# EAGLE design RelayWing (EAGLE 9.1.3)
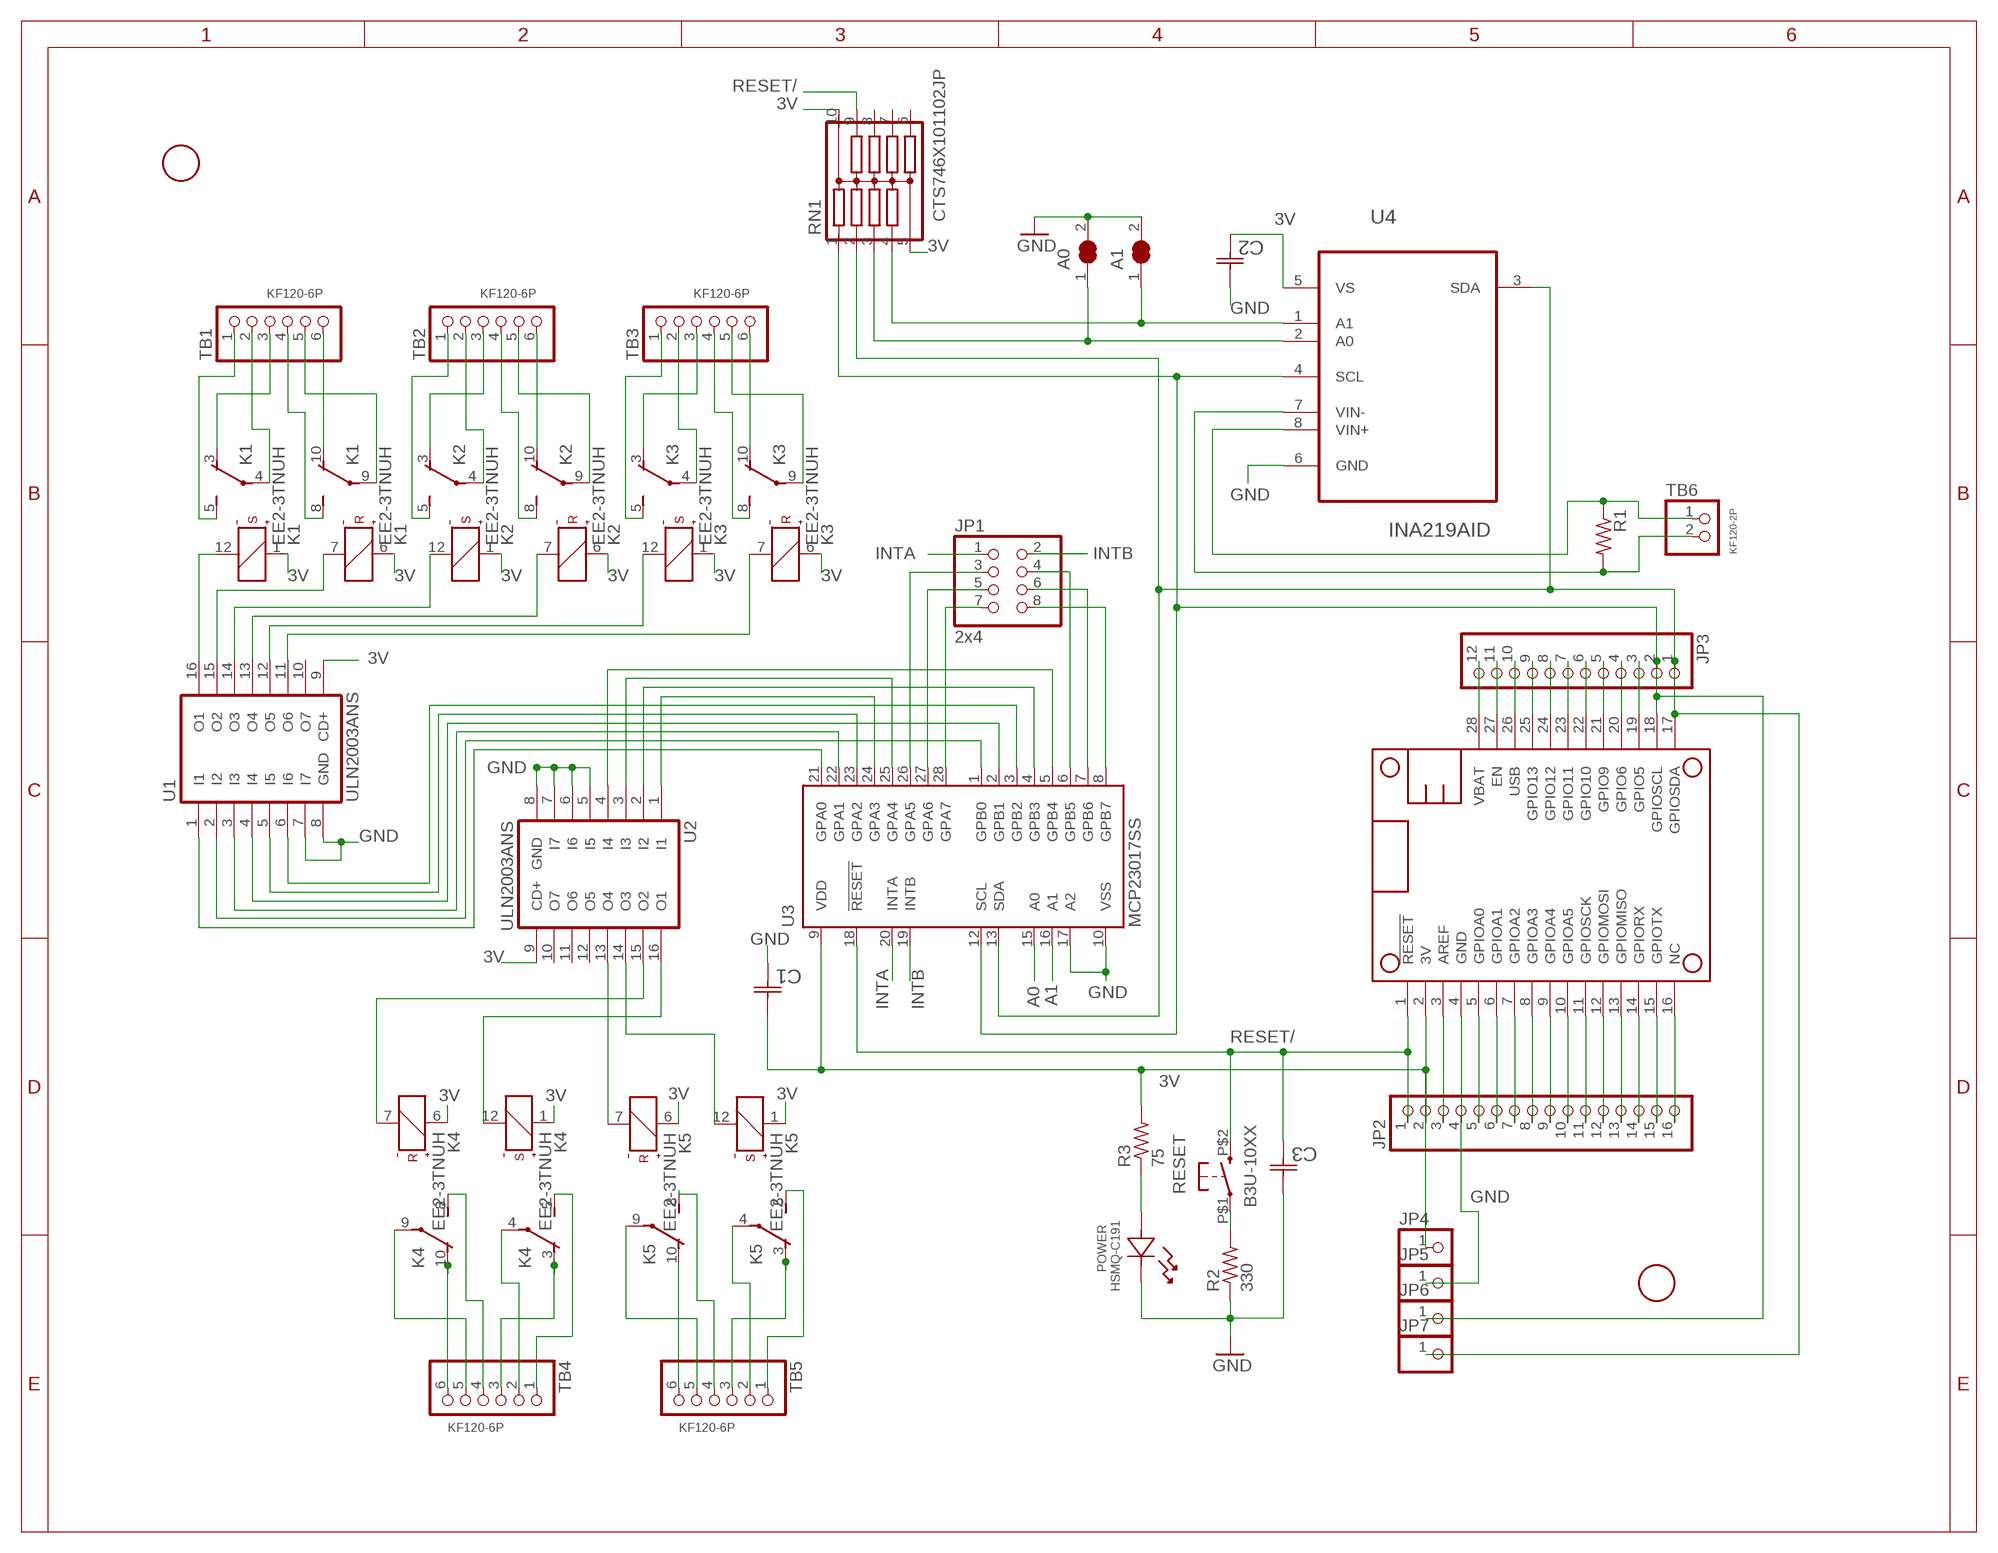
[diagram p0: schematic, sheet 1]

## Parts
A0  SJW-SHORTED  [SJW-SHORTED]
A1  SJW-SHORTED  [SJW-SHORTED]
C1  MUR-1220-CAP  [CAPC2012]
C2  MUR-1220-CAP  [CAPC2012]
C3  MUR-1220-CAP  [CAPC2012]
JP1  2x4  PINHD-2X4  [2X04]
JP2  PINHD-1X16  [1X16]
JP3  PINHD-1X12  [1X12]
JP4  PINHD-1X1CB  [1X01-CLEANBIG]
JP5  PINHD-1X1CB  [1X01-CLEANBIG]
JP6  PINHD-1X1CB  [1X01-CLEANBIG]
JP7  PINHD-1X1CB  [1X01-CLEANBIG]
K1  EE2-3TNUH  [NUH]
K2  EE2-3TNUH  [NUH]
K3  EE2-3TNUH  [NUH]
K4  EE2-3TNUH  [NUH]
K5  EE2-3TNUH  [NUH]
MS1  FEATHERWING_NODIM  [FEATHERWING_DIM]
POWER  HSMQ-C191  [LED3_HSMX-C120]
R1  0.1  R-US_M3216  [M3216]
R2  330  R-US_R0603  [R0603]
R3  75  R-US_R0603  [R0603]
RESET  B3U-10XX  [B3U-10XX]
RN1  CTS746X101102JP  CTS746X  [CTS746X101]
TB1  KF120-6P  [KF120-6P_ROUND]
TB2  KF120-6P  [KF120-6P_ROUND]
TB3  KF120-6P  [KF120-6P_ROUND]
TB4  KF120-6P  [KF120-6P_ROUND]
TB5  KF120-6P  [KF120-6P_ROUND]
TB6  KF120-2P  [KF120-2P_ROUND]
U1  ULN2003ANS  [SO16-NS]
U2  ULN2003ANS  [SO16-NS]
U3  MCP23017SS  [SSOP28]
U4  INA219AID  [SOIC127P600X175-8N]
U$2  FIDUCIAL  [FIDUCIAL_1MM]
U$3  FIDUCIAL  [FIDUCIAL_1MM]

## Nets
3V: C1.1(C1) C2.2(C2) JP2.2 JP4.1 K1.1(S:+) K1.6(R:+) K2.1(S:+) K2.6(R:+) K3.1(S:+) K3.6(R:+) K4.1(S:+) K4.6(R:+) K5.1(S:+) K5.6(R:+) MS1.2(3V) R3.2 RN1.5(5C) RN1.10(10C) U1.9(CD+) U2.9(CD+) U3.9(VDD) U4.5(VS)
A0: A0.1 RN1.3 U3.15(A0) U4.2(A0)
A1: A1.1 RN1.4 U3.16(A1) U4.1(A1)
GND: A0.2 A1.2 C1.2(C2) C2.1(C1) C3.1(C1) JP2.4 JP5.1 MS1.4(GND) POWER.1 R2.1 U1.7(I7) U1.8(GND) U2.5(I5) U2.6(I6) U2.7(I7) U2.8(GND) U3.10(VSS) U3.17(A2) U4.6(GND)
GPA0: U1.1(I1) U3.21(GPA0)
GPA1: U1.3(I3) U3.22(GPA1)
GPA2: U1.5(I5) U3.23(GPA2)
GPA3: U2.1(I1) U3.24(GPA3)
GPA4: U2.3(I3) U3.25(GPA4)
GPA5: JP1.3 U3.26(GPA5)
GPA6: JP1.5 U3.27(GPA6)
GPA7: JP1.7 U3.28(GPA7)
GPB0: U1.2(I2) U3.1(GPB0)
GPB1: U1.4(I4) U3.2(GPB1)
GPB2: U1.6(I6) U3.3(GPB2)
GPB3: U2.2(I2) U3.4(GPB3)
GPB4: U2.4(I4) U3.5(GPB4)
GPB5: JP1.4 U3.6(GPB5)
GPB6: JP1.6 U3.7(GPB6)
GPB7: JP1.8 U3.8(GPB7)
INTA: JP1.1 U3.20(INTA)
INTB: JP1.2 U3.19(INTB)
K1-RESET: K1.7(R:-) U1.15(O2)
K1-SET: K1.12(S:-) U1.16(O1)
K1A-CO [Two Amp]: K1.4(1:P) TB1.2
K1A-NC [Two Amp]: K1.3(1:O) TB1.3
K1A-NO [Two Amp]: K1.5(1:S) TB1.1
K1B-CO [Two Amp]: K1.9(2:P) TB1.5
K1B-NC [Two Amp]: K1.10(2:O) TB1.6
K1B-NO [Two Amp]: K1.8(2:S) TB1.4
K2-RESET: K2.7(R:-) U1.13(O4)
K2-SET: K2.12(S:-) U1.14(O3)
K2A-CO [Two Amp]: K2.4(1:P) TB2.2
K2A-NC [Two Amp]: K2.3(1:O) TB2.3
K2A-NO [Two Amp]: K2.5(1:S) TB2.1
K2B-CO [Two Amp]: K2.9(2:P) TB2.5
K2B-NC [Two Amp]: K2.10(2:O) TB2.6
K2B-NO [Two Amp]: K2.8(2:S) TB2.4
K3-RESET: K3.7(R:-) U1.11(O6)
K3-SET: K3.12(S:-) U1.12(O5)
K3A-CO [Two Amp]: K3.4(1:P) TB3.2
K3A-NC [Two Amp]: K3.3(1:O) TB3.3
K3A-NO [Two Amp]: K3.5(1:S) TB3.1
K3B-CO [Two Amp]: K3.9(2:P) TB3.5
K3B-NC [Two Amp]: K3.10(2:O) TB3.6
K3B-NO [Two Amp]: K3.8(2:S) TB3.4
K4-RESET: K4.7(R:-) U2.15(O2)
K4-SET: K4.12(S:-) U2.16(O1)
K4A-CO [Two Amp]: K4.4(1:P) TB4.2
K4A-N0 [Two Amp]: K4.5(1:S) TB4.1
K4A-NC [Two Amp]: K4.3(1:O) TB4.3
K4B-CO [Two Amp]: K4.9(2:P) TB4.5
K4B-NC [Two Amp]: K4.10(2:O) TB4.6
K4B-NO [Two Amp]: K4.8(2:S) TB4.4
K5-RESET: K5.7(R:-) U2.13(O4)
K5-SET: K5.12(S:-) U2.14(O3)
K5A-CO [Two Amp]: K5.4(1:P) TB5.2
K5A-NC [Two Amp]: K5.3(1:O) TB5.3
K5A-NO [Two Amp]: K5.5(1:S) TB5.1
K5B-CO [Two Amp]: K5.9(2:P) TB5.5
K5B-NC [Two Amp]: K5.10(2:O) TB5.6
K5B-NO [Two Amp]: K5.8(2:S) TB5.4
N$1: JP2.3 MS1.3(AREF)
N$2: POWER.2 R3.1
N$3: JP2.5 MS1.5(GPIOA0)
N$4: JP2.6 MS1.6(GPIOA1)
N$5: JP2.7 MS1.7(GPIOA2)
N$6: JP2.8 MS1.8(GPIOA3)
N$7: JP2.9 MS1.9(GPIOA4)
N$8: JP2.10 MS1.10(GPIOA5)
N$9: JP2.11 MS1.11(GPIOSCK)
N$10: JP2.12 MS1.12(GPIOMOSI)
N$11: JP2.13 MS1.13(GPIOMISO)
N$12: JP2.14 MS1.14(GPIORX)
N$13: JP2.15 MS1.15(GPIOTX)
N$14: JP2.16 MS1.16(NC)
N$15: JP3.3 MS1.19(GPIO5)
N$19: JP3.4 MS1.20(GPIO6)
N$20: JP3.5 MS1.21(GPIO9)
N$21: JP3.6 MS1.22(GPIO10)
N$22: JP3.7 MS1.23(GPIO11)
N$23: JP3.8 MS1.24(GPIO12)
N$31: R2.2 RESET.P$1(P)
N$51: JP3.9 MS1.25(GPIO13)
N$61: JP3.11 MS1.27(EN)
RESET/: C3.2(C2) JP2.1 MS1.1(!RESET) RESET.P$2(S) RN1.9 U3.18(!RESET)
SCL: JP3.2 JP6.1 MS1.18(GPIOSCL) RN1.1 U3.12(SCL) U4.4(SCL)
SDA: JP3.1 JP7.1 MS1.17(GPIOSDA) RN1.2 U3.13(SDA) U4.3(SDA)
USB: JP3.10 MS1.26(USB)
VBAT: JP3.12 MS1.28(VBAT)
VIN+: R1.1 TB6.1 U4.8(VIN+)
VIN-: R1.2 TB6.2 U4.7(VIN-)
Unconnected: RN1.6 RN1.7 RN1.8 U1.10(O7) U2.10(O7) U2.11(O6) U2.12(O5)

## Library data of the parts
A0 A1 = home:SJW-SHORTED: SMD solder JUMPER
C1-C3 = home:MUR-1220-CAP: CAPACITOR, 0805
JP1 = pinhead:PINHD-2X4: PIN HEADER
JP2 = pinhead:PINHD-1X16: PIN HEADER
JP3 = pinhead:PINHD-1X12: PIN HEADER
JP4-JP7 = adafruit:PINHD-1X1: Pin header 1x1 for 0.1" spacing With round pins
K1-K5 = home:EE2-*T?: TX Relay 2 coil latching 2 AMP. HIGH CAPACITY RELAY WITH HIGH SURGE VOLTAGE & HIGH BREAKDOWN VOLTAGE Source: http://www.mew-europe.com/.. en_ds_61022_0001.pdf TX-S SMALL POLARIZED WITH HIGH SENSITIVITY 50mW Source: http://www.mew-europe.com/.. en_ds_61022_0022.pdf; PN: EE2-3TNUH
MS1 = microbuilder:FEATHERWING
POWER = DigiKey:HSMQ-C191; MANUFACTURER_PART_NUMBER: HSMQC191; VENDOR: Avago Technologies
R1 = resistor:R-US_: RESISTOR, American symbol
R2 R3 = home:R-US_: RESISTOR, American symbol
RESET = home:B3U-10XX: OMRON SWITCH
RN1 = home:CTS746X: Network Resistor CTS 746 Series Leadless Surface Mount Source: http://www.ctscorp.com/components/Datasheets/746.pdf Distributor: Digi Key
TB1-TB5 = home:KF120-6P: Kaweei KF120-6P 6-pin screw terminalblock, 0.1" spacing. Adafruit
TB6 = home:KF120-2P: Kaweei KF120-2P 2-pin screw terminal block, 0.1" spacing. Through-hole. Adafruit
U1 U2 = home:ULN2003ANS: DRIVER ARRAY
U3 = microchip:MCP23017: http://ww1.microchip.com/downloads/en/DeviceDoc/21952a.pdf Source: http://ww1.microchip.com/downloads/en/DeviceDoc/21952a.pdf; MF: MICROCHIP; MPN: MCP23017-E/SS; OC_FARNELL: 1467674; OC_NEWARK: 31K2960
U4 = home:INA219AID: CURRENT/ POWER MONITOR; MPN: INA219AID; OC_FARNELL: -; OC_NEWARK: 45P7635; PACKAGE: SOIC-8; SUPPLIER: Texas Instruments
U$2 U$3 = adafruit:FIDUCIAL: For use by pick and place machines to calibrate the vision/machine, 1mm By microbuilder.eu

## Net classes
0 default: width 0.203 mm, clearance 0.203 mm
1 Two Amp: width 0.813 mm, clearance 0.203 mm

## Board
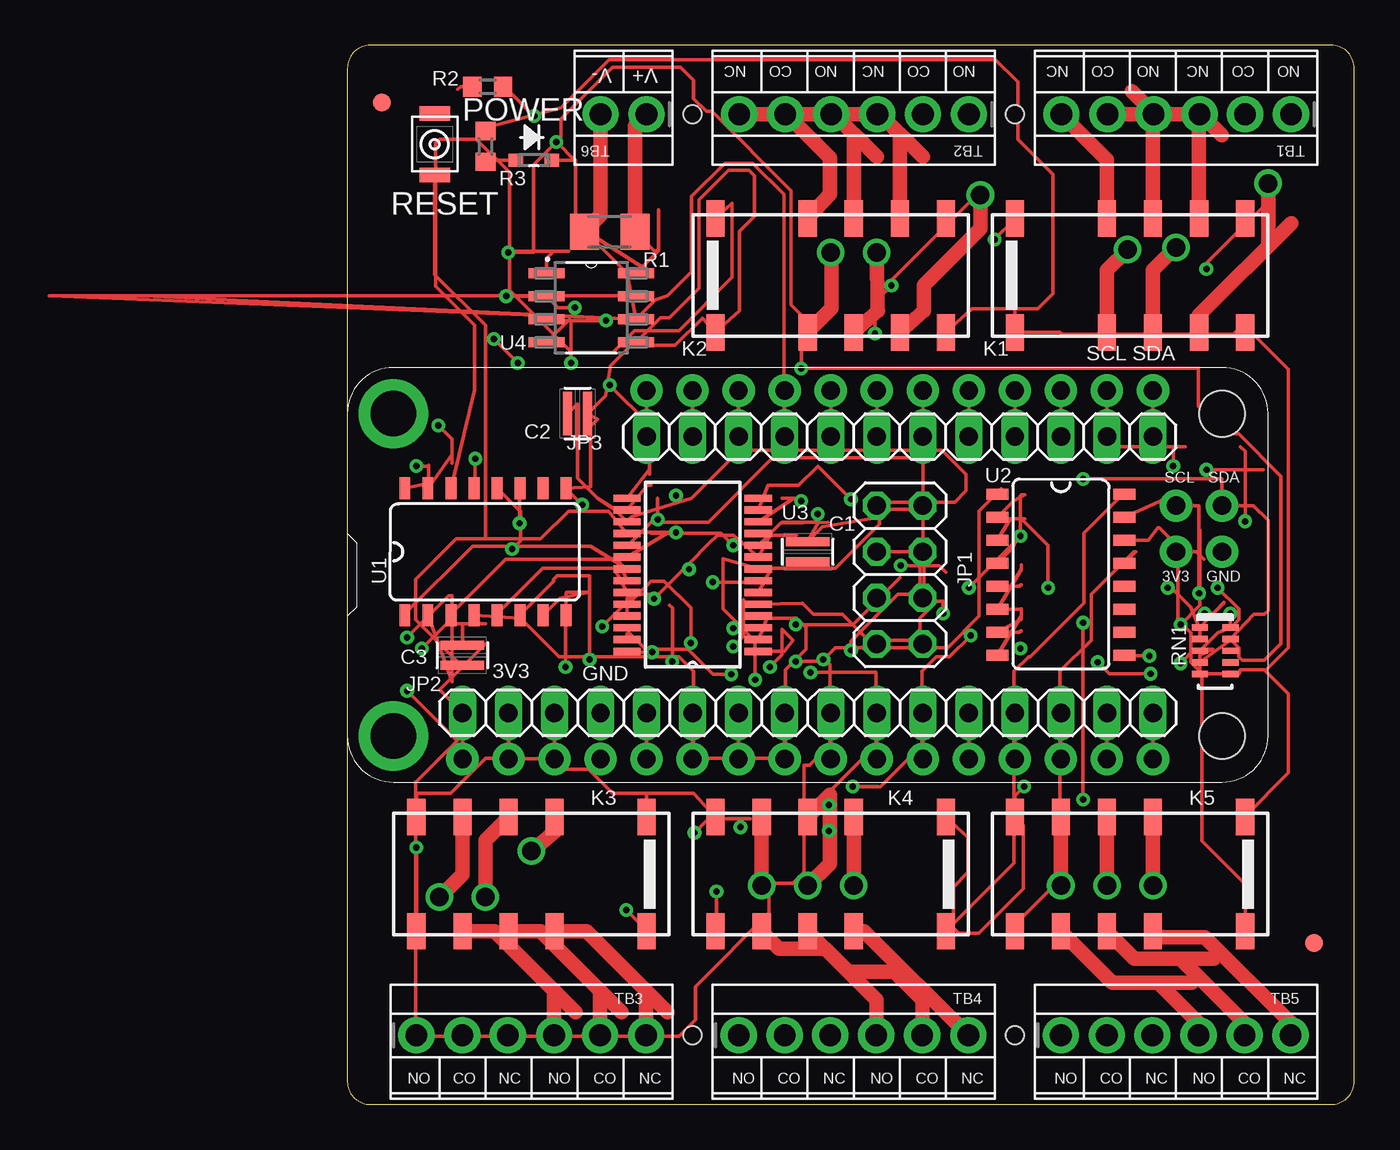
[diagram p1: board, top side]
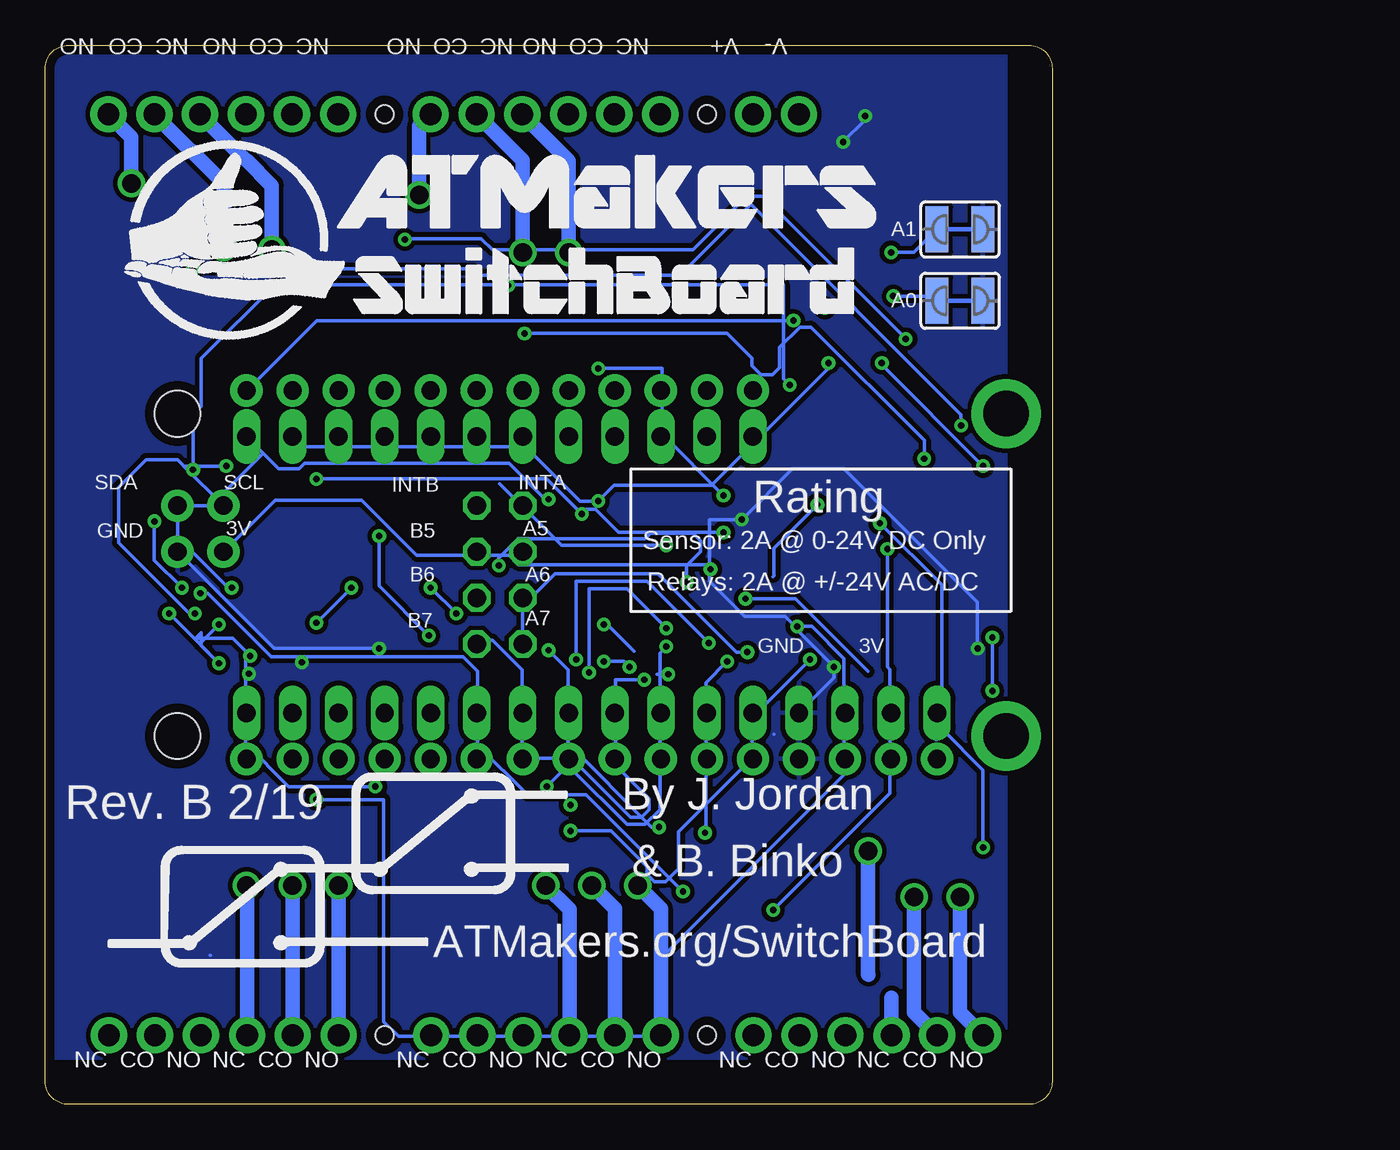
[diagram p2: board, bottom side, seen from below]

Size 55.55 x 58.41 mm. Coordinates in mm from the lower left corner, seen from the top.
Outline: 1.27,0 54.28,0 arc90 55.55,1.27 55.55,57.14 arc90 54.28,58.41 1.27,58.41 arc90 0,57.14 0,1.27 arc90 1.27,0
Copper layers (1*16): Top 0.035mm / dielectric 1.5mm / Bottom 0.035mm
Design rules "default *": minimum track width 8mil, minimum drill 0.35mm, track to track 6mil, track to pad 6mil, pad to pad 6mil, via to via 6mil, smd to smd 6mil, copper to edge 20mil, drill to drill 6mil, minimum pad ring 10mil, minimum via ring 8mil, stop-mask expansion 4mil, vias tented up to drill 45mil, thermal gap 10mil
Holes 1.02 mm at 19.05,54.61 36.83,54.61 19.05,3.81 36.83,3.81

### Footprints (pad centres in the part's own frame; a part is rotated, then mirrored left to right if it is on the bottom)
SJW-SHORTED = smd 1.27 x 2.54: 1 -1.27,0; 2 1.27,0
CAPC2012 = smd 0.5 x 2.4: 1 -0.55,0; 2 0.55,0
2X04 = drill 1.016 octagon: 1 -3.81,-1.27; 2 -3.81,1.27; 3 -1.27,-1.27; 4 -1.27,1.27; 5 1.27,-1.27; 6 1.27,1.27; 7 3.81,-1.27; 8 3.81,1.27
1X16 = drill 1.016 long: 1 -19.05,0; 2 -16.51,0; 3 -13.97,0; 4 -11.43,0; 5 -8.89,0; 6 -6.35,0; 7 -3.81,0; 8 -1.27,0; 9 1.27,0; 10 3.81,0; 11 6.35,0; 12 8.89,0; 13 11.43,0; 14 13.97,0; 15 16.51,0; 16 19.05,0
1X12 = drill 1.016 long: 1 -13.97,0; 2 -11.43,0; 3 -8.89,0; 4 -6.35,0; 5 -3.81,0; 6 -1.27,0; 7 1.27,0; 8 3.81,0; 9 6.35,0; 10 8.89,0; 11 11.43,0; 12 13.97,0
1X01-CLEANBIG = drill 1.016 pad 1.778: 1 0,0
NUH = smd 1 x 2: 1 -6.35,-3.145; 3 -1.27,-3.145; 4 1.27,-3.145; 5 3.81,-3.145; 6 6.35,-3.145; 7 6.35,3.145; 8 3.81,3.145; 9 1.27,3.145; 10 -1.27,3.145; 12 -6.35,3.145
FEATHERWING_DIM = drill 1 pad 1.778: 1 6.35,1.27; 2 8.89,1.27; 3 11.43,1.27; 4 13.97,1.27; 5 16.51,1.27; 6 19.05,1.27; 7 21.59,1.27; 8 24.13,1.27; 9 26.67,1.27; 10 29.21,1.27; 11 31.75,1.27; 12 34.29,1.27; 13 36.83,1.27; 14 39.37,1.27; 15 41.91,1.27; 16 44.45,1.27; 17 44.45,21.59; 18 41.91,21.59; 19 39.37,21.59; 20 36.83,21.59; 21 34.29,21.59; 22 31.75,21.59; 23 29.21,21.59; 24 26.67,21.59; 25 24.13,21.59; 26 21.59,21.59; 27 19.05,21.59; 28 16.51,21.59 | drill 2.5 pad 3.81: P$1 2.54,20.32; P$2 2.54,2.54 | hole 2.54: 48.26,20.32; 48.26,2.54
LED3_HSMX-C120 = smd 0.787 x 0.711: 1 -0.991,0; 2 0.991,0
M3216 = smd 1.6 x 2: 1 -1.4,0; 2 1.4,0
R0603 = smd 1 x 1.1: 1 -0.85,0; 2 0.85,0
B3U-10XX = smd 0.8 x 1.7: P$1 -1.7,0; P$2 1.7,0
CTS746X101 = smd 0.35 x 0.9: 1 -1.28,-0.85; 2 -0.64,-0.85; 3 0,-0.85; 4 0.64,-0.85; 5 1.28,-0.85; 6 1.28,0.85; 7 0.64,0.85; 8 0,0.85; 9 -0.64,0.85; 10 -1.28,0.85
KF120-6P_ROUND = drill 1.2 pad 2: 1 -6.35,0; 2 -3.81,0; 3 -1.3,0; 4 1.24,0; 5 3.78,0; 6 6.32,0
KF120-2P_ROUND = drill 1.2 pad 2: 1 -1.27,0; 2 1.27,0
SO16-NS = smd 0.6 x 1.2: 1 -4.445,-3.5; 2 -3.175,-3.5; 3 -1.905,-3.5; 4 -0.635,-3.5; 5 0.635,-3.5; 6 1.905,-3.5; 7 3.175,-3.5; 8 4.445,-3.5; 9 4.445,3.5; 10 3.175,3.5; 11 1.905,3.5; 12 0.635,3.5; 13 -0.635,3.5; 14 -1.905,3.5; 15 -3.175,3.5; 16 -4.445,3.5
SSOP28 = smd 0.4 x 1.5: 1 -4.225,-3.625; 2 -3.575,-3.625; 3 -2.925,-3.625; 4 -2.275,-3.625; 5 -1.625,-3.625; 6 -0.975,-3.625; 7 -0.325,-3.625; 8 0.325,-3.625; 9 0.975,-3.625; 10 1.625,-3.625; 11 2.275,-3.625; 12 2.925,-3.625; 13 3.575,-3.625; 14 4.225,-3.625; 15 4.225,3.625; 16 3.575,3.625; 17 2.925,3.625; 18 2.275,3.625; 19 1.625,3.625; 20 0.975,3.625; 21 0.325,3.625; 22 -0.325,3.625; 23 -0.975,3.625; 24 -1.625,3.625; 25 -2.275,3.625; 26 -2.925,3.625; 27 -3.575,3.625; 28 -4.225,3.625
SOIC127P600X175-8N = smd 1.981 x 0.559: 1 -2.464,1.905; 2 -2.464,0.635; 3 -2.464,-0.635; 4 -2.464,-1.905; 5 2.464,-1.905; 6 2.464,-0.635; 7 2.464,0.635; 8 2.464,1.905
FIDUCIAL_1MM = smd 1 x 1: 1 0,0

### Placement (x,y rotation side)
A0  5.08,44.32 0 bottom
A1  5.08,48.26 0 bottom
C1  25.4,30.48 90 top
C2  12.7,38.1 0 top
C3  6.35,24.77 270 top
JP1  30.48,29.21 270 top
JP2  25.4,21.59 0 top
JP3  30.48,36.83 180 top
JP4  45.72,30.48 0 top
JP5  48.26,30.48 0 top
JP6  45.72,33.02 0 top
JP7  48.26,33.02 0 top
K1  43.18,45.72 0 top
K2  26.67,45.72 0 top
K3  10.16,12.7 180 top
K4  26.67,12.7 180 top
K5  43.18,12.7 180 top
MS1  0,17.78 0 top
POWER  10.29,52.07 180 top
R1  14.48,48.13 180 top
R2  7.75,56.13 180 top
R3  7.62,52.83 90 top
RESET  4.83,52.96 270 top
RN1  47.88,25.02 270 top
TB1  45.72,54.61 180 top
TB2  27.94,54.61 180 top
TB3  10.16,3.81 0 top
TB4  27.94,3.81 0 top
TB5  45.72,3.81 0 top
TB6  15.24,54.61 180 top
U1  7.62,30.48 0 top
U2  39.37,29.21 270 top
U3  19.05,29.21 90 top
U4  13.46,43.94 0 top
U$2  1.91,55.24 0 top
U$3  53.34,8.89 0 top

### Tracks (layer width: path | path; a pad name or v marks a point on that pad's centre or on a via)
3V  (via drill 0.35)
  Top 0.203: 16.51,17.17 19.11,17.17 K4.6 | MS1.2 8.84,19.1 7.62,19.1 5.69,17.17 3.81,17.17 K3.6 | 16.51,17.17 14.63,17.17 13.31,18.49 11.89,18.49 11.33,19.05 MS1.2 | 16.51,17.17 K3.1 | v16.92,27.89 18.85,29.82 | JP2.2 MS1.2 | U4.5 17.27,43.38 17.78,43.38 19.41,45.01 19.41,49.89 21.03,51.51 22.15,51.51 22.45,51.21 22.45,48.97 21.64,48.16 21.64,43.78 K2.1 19.59,43.37 18.09,41.86 15.65,41.86 14.53,40.74 14.24,39.09 C2.2 13.81,37.79 13.41,37.39 13.41,34.07 U1.9 12.14,33.88 v12.95,33.07 | K2.6 34.47,43.89 38.1,43.89 38.91,44.7 38.91,51.31 36.98,53.24 36.98,56.39 35.76,57.61 14.43,57.61 11.79,54.97 7.85,53.91 R3.2 | 49.43,43.03 48.87,42.47 39.42,42.47 39.31,42.58 K1.1 36.83,43.89 | 49.43,43.03 49.53,43.13 K1.6 | K4.1 34.24,14.74 34.24,12.8 33.43,11.99 33.43,9.75 33.73,9.45 34.85,9.45 37.29,11.89 37.29,15.39 K5.6 36.83,17.02 v37.34,17.53 | 50.65,23.93 51.92,22.66 51.92,18.29 49.53,15.9 K5.1 | 50.65,23.93 50.6,23.98 49.28,23.98 49.22,23.74 RN1.5 47.03,24.77 47.75,25.09 46.74,25.09 v45.97,24.33 | v48.72,27.08 48.72,26.36 RN1.10 | v44.25,24.74 42.93,24.74 U2.9 | 49.43,43.03 51.92,40.54 51.92,25.2 50.65,23.93 | 47.04,31.7 47.04,27.53 v45.97,26.47 | 47.24,30.07 46.84,30.48 JP4.1 | 18.85,29.82 19.96,30.94 20.42,31.39 21.3,31.39 U3.9 23.33,31.39 24.79,31.39 | v18.85,29.52 18.85,29.82
  Bottom 0.203: v16.92,27.89 14.17,27.89 10.16,23.88 | JP2.2 8.89,22.61 | v12.95,33.07 15.34,30.68 15.34,29.16 15.39,29.11 | JP4.1 42.88,33.33 38.1,33.33 35.05,30.28 29.97,30.28 29.46,29.77 19.1,29.77 v18.85,29.52 | 47.04,25.4 v45.97,24.33 46.94,25.3 46.94,26.01 47.24,25.7 45.21,25.7 v44.25,24.74 44.5,24.49 44.5,19.91 42.11,17.53 v37.34,17.53 | 47.04,25.4 v48.72,27.08 | 47.04,25.4 v45.97,26.47
A0  (via drill 0.35)
  Top 0.203: v48.01,28.5 49.17,27.33 49.17,26.72 48.77,26.31 48.02,26.01 RN1.3 | v49.53,32.16 49.53,36.02 49.28,36.27 | v47.4,35 50.55,35 | v12.55,43.94 11.63,43.94 U4.2 v8.76,44.58 | 16.66,34.75 16.66,37.49 v14.48,39.67 | 16.66,35.04 U3.15
  Bottom 0.203: v48.01,28.5 49.53,30.02 v49.53,32.16 | v47.4,35 47.4,38.05 46.94,38.51 46.94,41.15 42.88,45.21 14.83,45.21 14.83,40.03 v14.48,39.67 | v8.76,44.58 6.6,44.58 A0.1
A1  (via drill 0.35)
  Top 0.203: 16.76,34.14 16.55,34.14 U3.16 | RN1.4 48.7,25.6 48.77,25.6 49.17,25.2 49.17,24.69 49.38,24.49 50.6,24.49 51.51,25.4 51.51,34.65 49.17,36.98 48.46,36.98 46.94,38.51 46.94,40.59 v25.04,40.59 25.04,43.54 24.49,44.09 24.49,50.39 20.12,54.76 19.81,54.76 19.1,55.47 19.1,56.49 18.39,57.2 14.63,57.2 11.79,54.36 11.79,53.34 10.26,51.82 10.26,46.99 v8.89,46.99 8.94,47.04 12.19,47.04 | 11.38,47.04 11,46.66 U4.1
  Bottom 0.203: v25.04,40.59 21.54,40.59 21.54,36.98 v18.14,33.58 | v8.89,46.99 7.62,46.99 A1.1
GND  (via drill 0.35)
  Top 0.203: 37.19,27.23 37.19,26.96 U2.8 | 37.19,26.11 37.06,26.04 U2.7 37.19,26.77 37.19,27.33 37.17,27.3 U2.6 37.19,29.5 37.19,29.77 | 37.19,28.65 37.06,28.57 U2.5 | U1.7 11.74,27.92 13.31,28.25 12.09,28.25 12.06,28.12 U1.8 12.04,26.87 v12.04,24.13 | v37.13,25.15 37.19,25.15 | 16.56,44.6 -16.46,44.6 U4.6 | C2.1 12.66,38.61 12.7,38.61 12.7,34.54 13.82,33.43 14.74,32.82 U3.17 15.69,32.4 19,33.43 21.64,36.07 24.08,36.07 | 24.08,36.07 24.08,50.19 22.35,51.92 20.83,51.92 19,50.09 19,45.92 17.68,44.6 16.99,44.37 U4.6 | 17.12,33.43 v17.12,32.26 | -11.28,44.6 U4.6 | 12.6,52.02 12.6,52.07 POWER.1 | U4.6 15.42,45.85 12.6,48.67 12.6,52.02 | v10.31,54.51 8.69,56.13 R2.1 | v11.53,53.09 12.6,52.02 | 6.35,26.52 5.49,26.52 v4.12,25.15 | 6.35,26.52 7.62,26.52 | 6.35,26.52 C3.1 | 23.98,32.11 25.99,32.11 C1.2 26.22,31.85 28.85,32.31 29.77,33.22 33.53,33.22 34.14,33.83 34.14,34.75 32.82,36.07 24.08,36.07 | v44.32,23.75 42.04,23.75 v41.4,24.38 | 26.52,32.11 23.9,32.06 U3.10
  Bottom 0.203: JP2.4 12.04,23.52 v12.04,24.13 13.92,26.01 13.92,26.11 14.73,26.92 16.97,26.92 18.9,28.85 18.9,32.26 v17.12,32.26 14.33,35.05 11.48,35.05 4.12,27.69 v4.12,25.15 | v37.13,25.15 42.93,25.15 JP5.1 | 46.43,8.23 46.45,8.23 | v10.31,54.51 10.31,54.3 v11.53,53.09 | 6.4,20.12 6.38,20.12 | 15.34,20.42
  pour Bottom (isolate 0.254): 55.88,58.42 2.54,58.42 2.54,2.54 55.88,2.54
GPA0
  Top 0.203: U1.1 3.2,27.08 6.91,30.79 13.41,30.79 U3.21
GPA1
  Top 0.203: U1.3 5.74,27.08 8.74,30.07 14.95,30.07 U3.22
GPA2
  Top 0.203: U1.5 8.28,27.08 10.77,29.57 14.71,29.57 U3.23
GPA3  (via drill 0.35)
  Top 0.203: v26.26,24.54 26.92,25.2 33.12,25.2 34.85,26.92 34.85,32.72 36.1,33.96 U2.1 | v18.95,25.45 18.95,27.38 17.48,28.85 16.76,28.85 15.49,27.58 U3.24
  Bottom 0.203: v26.26,24.54 26.26,28.85 22.35,28.85 v18.95,25.45
GPA4  (via drill 0.35)
  Top 0.203: 37.39,32.31 36.58,32.31 U2.3 | v38.66,28.5 38.66,30.84 37.19,32.31 | v40.59,16.82 v40.59,26.57 | 15.85,28.14 v14.07,26.36 | 16.66,28.14 15.85,28.14 | 15.85,28.14 15.43,27.92 U3.25
  Bottom 0.203: v40.59,26.57 v38.66,28.5 | v40.59,16.82 36.88,16.82 36.88,4.57 36.07,3.76 22.25,3.76 21.54,4.47 21.54,8.13 11.48,18.19 11.48,24.59 13.26,26.36 v14.07,26.36
GPA5  (via drill 0.35)
  Top 0.203: 17.78,27.53 17.93,27.38 v17.93,24.43 | v19.15,14.99 19.91,15.75 22.25,15.75 | v27.79,25.04 27.79,25.55 30.38,28.14 30.99,28.14 31.6,28.75 31.6,30.18 31.29,30.48 JP1.3
  Bottom 0.203: v17.93,24.43 19.1,23.27 19.1,17.58 | 19.1,20.83 19.1,15.04 v19.15,14.99 | v21.69,15.29 22.1,15.29 26.72,19.91 26.72,23.98 v27.79,25.04
GPA6  (via drill 0.35)
  Top 0.203: v21.18,23.72 20.17,23.72 18.8,25.09 16.46,25.09 15.54,26.01 15.43,25.96 U3.27 | v24.74,26.47 27.89,26.47 30.48,29.06 | JP1.5 29.21,27.79
  Bottom 0.203: 21.79,23.72 v21.18,23.72 | 23.06,24.99 24.54,26.47 v24.74,26.47
GPA7  (via drill 0.35)
  Top 0.203: v16.82,24.94 15.49,24.94 U3.28
  Bottom 0.203: v16.82,24.94 17.42,24.94 21.74,29.26 27.43,29.26 29.21,27.48 JP1.7
GPB0  (via drill 0.35)
  Top 0.203: v24.74,24.43 26.47,24.43 26.62,24.28 26.62,19.81 25.5,18.69 25.2,18.69 25.2,12.8 24.59,12.19 23.47,12.19 23.27,11.99 23.27,10.57 19.2,6.5 19.2,4.67 18.29,3.76 4.47,3.76 3.76,4.47 3.76,17.78 6.04,20.07 v3.3,22.81 | v23.32,24.13 23.98,24.79 23.98,26.21 24.59,25.6 24.11,24.98 U3.1 | v3.3,25.76 5.59,28.04 5.79,28.04 5.79,23.3 U1.2
  Bottom 0.203: v24.74,24.43 23.62,24.43 v23.32,24.13 | v3.3,22.81 v3.3,25.76
GPB1
  Top 0.203: U1.4 9.57,26.8 11.68,24.69 18.29,24.69 19.1,23.88 19.1,19.81 19.81,19.1 23.37,19.1 24.18,19.91 24.18,23.98 25.3,25.09 25.3,26.31 24.79,26.82 23.14,26.82 U3.2
GPB2  (via drill 0.35)
  Top 0.203: v13.36,24.54 13.36,29.16 11.58,29.16 11.38,28.96 11.38,28.85 9.6,27.08 U1.6 | v25.55,23.82 29.16,23.82 29.16,19.81 26.57,17.22 v26.57,16.51 v26.57,15.09 | v21.29,26.26 22.61,26.26 U3.3
  Bottom 0.203: v13.36,24.54 16.56,21.34 16.56,19.1 20.62,15.04 20.62,13.01 21.34,12.29 21.95,12.29 22.35,12.7 22.35,13.11 24.33,15.09 v26.57,15.09 | v25.55,23.82 25.55,28.45 23.47,28.45 v21.29,26.26
GPB3  (via drill 0.35)
  Top 0.203: v37.13,31.34 37.13,33.58 37.19,33.63 37.39,33.63 36.77,33.28 U2.2 | v34.39,25.86 33.22,24.69 32.51,24.69 31.7,23.88 31.7,19.81 29.41,17.53 v27.89,17.53 | v21.29,25.25 21.84,25.81 21.84,27.84
  Bottom 0.203: v37.13,31.34 37.13,28.6 v34.39,25.86 | v27.89,17.53 26.92,18.49 26.52,18.49 23.47,15.44 22.45,15.44 21.64,16.26 21.64,24.89 v21.29,25.25
GPB4  (via drill 0.35)
  Top 0.203: 36.88,31.09 37.08,31.09 | v34.29,28.5 36.88,31.09 | v32.87,27.08 32.87,27.74 32.51,27.74 31.6,26.82 31.6,26.21 30.99,25.6 28.75,25.6 27.33,27.03 25.7,27.03 25.1,27.63 U3.5 | 36.88,31.09 36.69,30.66 U2.4
  Bottom 0.203: v32.87,27.08 v34.29,28.5
GPB5
  Top 0.203: JP1.4 31.75,32.82 29.97,32.82 29.36,32.21 29.36,32 26.92,29.57 23.39,29.57 U3.6
GPB6  (via drill 0.35)
  Top 0.203: v20.17,28.8 22.61,28.8 U3.7 | v30.53,29.72 32.66,29.72 33.02,29.36 | 31.8,30.58 31.8,27.99 JP1.6
  Bottom 0.203: v20.17,28.8 20.17,29.72 19.41,30.48 19.41,31.09 19.81,31.5 22.15,31.5 22.45,31.19 29.46,31.19 30.53,30.12 v30.53,29.72
GPB7  (via drill 0.35)
  Top 0.203: v22.5,23.42 22.5,25.55 20.73,27.33 20.73,30.11 U3.8
  Bottom 0.203: v22.5,23.42 24.08,23.42 24.08,18.69 22.25,16.87 22.25,16.26 22.66,15.85 23.27,15.85 26.52,19.1 28.45,19.1 29.26,19.91 29.26,23.98 30.89,25.6 31.75,25.6 JP1.8
INTA  (via drill 0.35)
  Top 0.203: v21.29,30.84 20.62,31.5 16.76,31.5 | 17.63,31.5 U3.20
  Bottom 0.203: v21.29,30.84 27.08,30.84 30.48,34.24 | 29.21,32.97 JP1.1
INTB
  Top 0.203: U3.19 15.49,30.84 16.76,32.11 19.91,32.11 23.47,35.66 31.7,35.66 31.75,35.61 JP1.2
K1-RESET  (via drill 0.35)
  Top 0.203: v47.4,46.08 47.4,46.38 50.8,49.78 | K1.7 49.53,48.51 | 5.79,35.36 5.79,36.68 v5.03,37.44 | 5.79,35.87 U1.15
  Bottom 0.203: v47.4,46.08 31.95,46.08 31.6,45.72 20.52,45.72 16.61,49.63 5.03,38.05 v5.03,37.44
K1-SET  (via drill 0.35)
  Top 0.203: v35.71,47.7 36.83,48.82 K1.12 | v3.81,35.2 4.42,35.2 4.47,35.26 4.47,34.24 U1.16 | v9.4,40.89 v8.08,42.22
  Bottom 0.203: v35.71,47.7 35.66,47.75 31.5,47.75 30.89,47.14 19.81,47.14 16.87,50.09 15.95,50.09 v8.08,42.22 | v3.81,35.2 9.45,40.84 v9.4,40.89
K1A-CO  (via drill 1.02)
  Top 0.813: v45.72,47.27 44.45,46 K1.4
  Bottom 0.813: TB1.2 45.72,50.8 v45.72,47.27
K1A-NC  (via drill 1.02)
  Top 0.813: v43.05,47.14 41.91,46 K1.3
  Bottom 0.813: v43.05,47.14 43.05,50.67 44.45,52.07 44.57,52.16 TB1.3
K1A-NO  (via drill 1.02)
  Top 0.813: 52.07,48.6 46.99,43.52 K1.5 | 50.8,47.33 v50.8,50.8
  Bottom 0.813: v50.8,50.8 50.8,53.34 TB1.1
K1B-CO
  Top 0.813: 44.55,54.61 TB1.5 | K1.9 44.45,54.71 43.28,55.88
K1B-NC
  Top 0.813: K1.10 41.91,52.1 TB1.6
K1B-NO
  Top 0.813: TB1.4 47.09,54.61 48.26,53.44 | K1.8 46.99,54.71
K2-RESET  (via drill 0.35)
  Top 0.203: v7.06,35.61 7.06,33.98 U1.13 | 34.24,49.68 30.02,45.47 v30.02,45.16 29.11,44.25 v29.11,42.52
  Bottom 0.203: v7.06,35.61 7.06,36.63 13.31,42.88 13.92,42.88 15.04,41.76 15.04,40.64 15.44,40.23 16.05,40.23 16.56,40.74 16.56,41.15 17.93,42.52 v29.11,42.52
K2-SET
  Top 0.203: K2.12 21.23,49.7 21.23,45.62 18.29,42.67 15.85,42.67 14.63,41.45 12.39,41.45 8.94,44.91 8.94,51.41 7.11,53.24 5.08,53.24 4.88,53.03 4.88,45.11 7.01,42.98 7.01,39.43 U1.14
K2A-CO  (via drill 1.02)
  Top 0.813: v29.21,46.99 29.26,43.89 29.26,43.78 K2.4
  Bottom 0.813: v29.21,46.99 29.21,52.07 TB2.2
K2A-NC  (via drill 1.02)
  Top 0.813: K2.3 26.72,43.9 26.72,46.94 v26.67,46.99
  Bottom 0.813: v26.67,46.99 26.67,52.04 TB2.3
K2A-NO  (via drill 1.02)
  Top 0.813: v34.92,50.16 34.92,48.3 31.8,45.17 31.8,43.78 K2.5
  Bottom 0.813: v34.92,50.16 34.92,53.98 TB2.1
K2B-CO
  Top 0.813: K2.9 27.94,53.53 | TB2.5 26.86,54.61 29.21,52.26
K2B-NC
  Top 0.813: TB2.6 24.23,54.61 26.62,52.22 26.62,50.2 K2.10
K2B-NO
  Top 0.813: TB2.4 29.4,54.61 31.75,52.26 | K2.8 30.48,53.53
K3-RESET  (via drill 0.35)
  Top 0.203: v9.5,32.05 9.5,33.88 U1.11 | v3.81,14.17 K3.7
  Bottom 0.203: v9.5,32.05 6.1,28.65 6.1,20.73 3.81,18.44 v3.81,14.17
K3-SET  (via drill 0.35)
  Top 0.203: v9.09,30.63 9.55,31.09 9.55,32.72 9.53,32.71 U1.12 | v15.39,10.72 16.51,9.6 K3.12
  Bottom 0.203: v9.09,30.63 9.09,24.13 8.94,23.98 8.94,17.17 v15.39,10.72
K3A-CO  (via drill 1.02)
  Top 0.813: K3.4 7.62,14.57 v7.62,11.43
  Bottom 0.813: v7.62,11.43 7.62,5.08 TB3.2
K3A-NC  (via drill 1.02)
  Top 0.813: v10.16,13.97 11.43,15.03 K3.3
  Bottom 0.813: TB3.3 8.86,5.89 | 10.13,7.16 10.16,7.19 v10.16,13.97
K3A-NO  (via drill 1.02)
  Top 0.813: K3.5 6.35,12.7 v5.08,11.43
  Bottom 0.813: v5.08,11.43 5.08,5.08 TB3.1
K3B-CO
  Top 0.813: 13.94,6.28 TB3.5 | K3.9 10.66,9.55 15.14,5.08
K3B-NC
  Top 0.813: 16.48,6.28 TB3.6 | K3.10 13.2,9.55 17.68,5.08
K3B-NO
  Top 0.813: 11.4,6.28 TB3.4 | K3.8 8.12,9.55 12.6,5.08
K4-RESET  (via drill 0.35)
  Top 0.203: v46.99,28.19 46.99,33.02 46.53,33.02 45.92,33.63 45.61,33.63 U2.15 | v20.37,11.73 20.37,9.7 K4.7
  Bottom 0.203: v46.99,28.19 46.58,28.19 43.08,24.69 32.51,24.69 31.7,23.88 31.7,19.81 28.96,17.07 25.7,17.07 v20.37,11.73
K4-SET
  Top 0.203: U2.16 42.98,33.83 40.64,31.5 40.64,27.64 37.69,24.69 37.59,24.69 36.78,23.88 36.78,13.31 33.07,9.6 K4.12
K4A-CO  (via drill 1.02)
  Top 0.813: v25.4,12.06 26.62,13.28 26.62,17.07 26.57,17.01 K4.4
  Bottom 0.813: v25.4,12.06 24.13,10.79 TB4.2
K4A-N0  (via drill 1.02)
  Top 0.813: K4.5 v22.86,12.06
  Bottom 0.813: v22.86,12.06 21.59,10.79 TB4.1
K4A-NC  (via drill 1.02)
  Top 0.813: K4.3 v27.94,12.06
  Bottom 0.813: v27.94,12.06 26.64,10.77 TB4.3
K4B-CO
  Top 0.813: K4.9 27.64,7.32 30.18,7.32 31.72,5.78 TB4.5
K4B-NC
  Top 0.813: TB4.6 28.52,9.55 K4.10
K4B-NO
  Top 0.813: K4.8 23.83,8.59 26.37,8.59 29.18,5.78 TB4.4
K5-RESET
  Top 0.203: K5.7 36.83,9.91 39.32,12.39 39.32,23.88 41.05,25.6 41.05,28.14 43.38,30.48 43.48,30.48 43.49,30.47 U2.13
K5-SET
  Top 0.203: U2.14 44.2,31.11 44.7,31.8 44.81,31.8 45.82,30.79 45.82,26.72 46.53,26.01 46.53,24.38 47.14,23.77 47.14,14.53 49.53,12.14 K5.12
K5A-CO  (via drill 1.02)
  Top 0.813: K5.4 v41.91,12.06
  Bottom 0.813: v41.91,12.06 TB5.2
K5A-NC  (via drill 1.02)
  Top 0.813: K5.3 v44.45,12.06
  Bottom 0.813: v44.45,12.06 44.42,12.04 TB5.3
K5A-NO  (via drill 1.02)
  Top 0.813: K5.5 v39.37,12.06
  Bottom 0.813: TB5.1 v39.37,12.06
K5B-CO
  Top 0.813: 47.81,8.04 43.43,8.04 K5.9 | TB5.5 49.5,4.5 45.97,8.04
K5B-NC
  Top 0.813: K5.10 44.78,9.22 47.32,9.22 52.04,4.5 TB5.6
K5B-NO
  Top 0.813: 46.59,6.71 42.21,6.71 K5.8 | TB5.4 46.96,4.5 44.75,6.71
N$1
  Top 0.203: MS1.3 JP2.3
N$2
  Top 0.203: POWER.2 7.67,52.07 R3.1
N$3
  Top 0.203: MS1.5 JP2.5
N$4
  Top 0.203: MS1.6 JP2.6
N$5
  Top 0.203: MS1.7 JP2.7
N$6
  Top 0.203: MS1.8 JP2.8
N$7
  Top 0.203: MS1.9 JP2.9
N$8
  Top 0.203: MS1.10 JP2.10
N$9
  Top 0.203: MS1.11 JP2.11
N$10
  Top 0.203: MS1.12 JP2.12
N$11
  Top 0.203: MS1.13 JP2.13
N$12
  Top 0.203: MS1.14 JP2.14
N$13
  Top 0.203: MS1.15 JP2.15
N$14
  Top 0.203: MS1.16 JP2.16
N$15
  Top 0.203: MS1.19 JP3.3
N$19
  Top 0.203: MS1.20 JP3.4
N$20
  Top 0.203: MS1.21 JP3.5
N$21
  Top 0.203: MS1.22 JP3.6
N$22
  Top 0.203: MS1.23 JP3.7
N$23
  Top 0.203: MS1.24 JP3.8
N$31
  Top 0.203: R2.2 6.25,56.13 6.1,55.98 | 4.83,54.71 RESET.P$1
N$51
  Top 0.203: MS1.25 JP3.9
N$61
  Top 0.203: MS1.27 JP3.11
RESET/  (via drill 0.35)
  Top 0.203: v40.59,34.49 48.26,34.49 48.26,33.83 49.07,33.02 49.99,33.02 50.8,32.21 50.8,27.23 50.6,27.03 50,27.03 RN1.9 | 7.62,31.19 5.99,31.19 3.76,28.96 3.76,26.72 6.35,24.13 | 7.62,31.19 10.67,31.19 12.19,32.72 14.42,32.72 U3.18 15.49,31.55 v18.14,31.55 | MS1.1 JP2.1 5.08,22.86 6.35,24.13 | RESET.P$2 4.83,45.77 7.62,42.98 7.62,31.19 | 6.35,24.13 7.62,25.4 | 6.35,24.13 C3.2
  Bottom 0.203: v40.59,34.49 27.89,34.49 v25.96,32.56 25.7,32.82 25.2,32.82 23.93,31.55 v18.14,31.55
SCL  (via drill 0.35)
  Top 0.203: v47.3,27.08 47.8,27.08 48.36,27.64 48.36,27.71 RN1.1 | 23.98,33.43 24.89,33.43 v25.04,33.27 | 24.64,33.43 U3.12 | MS1.18 JP3.2 42.47,36.27 46.23,36.27 | v45.57,35.2 45.57,36.27 45.01,36.27 | v12.34,40.89 12.34,43.23 12.29,43.28 12.24,43.28 U4.4
  Bottom 0.203: v47.3,27.08 47.6,27.08 51.51,30.99 51.51,34.04 49.99,35.56 48.26,35.56 48.01,35.31 47.9,35.2 | JP6.1 47.9,35.2 | JP3.2 41.35,36.27 29.06,36.27 26.06,33.27 v25.04,33.27 24.18,34.14 18.8,34.14 12.34,40.59 v12.34,40.89 | v45.57,35.2 47.9,35.2
SDA  (via drill 0.35)
  Top 0.203: v45.26,28.5 45.47,28.5 46.53,27.43 47.03,26.2 RN1.2 | v27.79,33.38 25.96,35.2 24.89,34.14 23.21,34.14 U3.13 | v14.28,43.23 11.02,43.23 U4.3 | MS1.17 JP3.1
  Bottom 0.203: v45.26,28.5 45.47,28.5 48.26,31.29 JP7.1 46.43,33.02 43.54,35.92 | v27.79,33.38 27.99,33.38 29.97,35.36 41.25,35.36 41.55,35.05 42.67,35.05 43.54,35.92 | JP3.1 43.54,35.92 | v14.28,43.23 40.59,43.23 MS1.17
USB
  Top 0.203: MS1.26 JP3.10
VBAT
  Top 0.203: MS1.28 JP3.12
VIN+
  Top 0.203: 17.17,49.35 17.17,47.09 U4.8 | 17.17,47.14 16.96,47.05 R1.1
  Top 0.813: R1.1 15.88,53.98 TB6.1
VIN-
  Top 0.203: 16.66,45.92 13.22,48.13 R1.2
  Top 0.813: R1.2 13.97,49.02 TB6.2

### Text on the board
tPlace: V- | V+ | NO CO NC | NO CO NC | NO CO NC | NO CO NC | NO CO NC | NO CO NC | NO CO NC | NO CO NC | NO CO NC | NO CO NC
tNames: SCL | SDA | SCL | SDA | 3V3 | GND | 3V3 | GND
bNames: V- | V+ | NC | CO | NO | NC | CO | NO | NC | CO | NO | NC | CO | NO | INTA | INTB | SCL | SDA | Rating | Sensor: 2A @ 0-24V DC Only | A5 | B5 | 3V | GND | A6 | B6 | Relays: 2A @ +/-24V AC/DC | A7 | B7 | 3V | GND | By J. Jordan | Rev. B 2/19 | & B. Binko | ATMakers.org/SwitchBoard | NO | CO | NC | NO | CO | NC | NO | CO | NC | NO | CO | NC | NO | CO | NC | NO | CO | NC